# Altium schematic sheet 10-USB-Prog.SchDoc
size B; SheetNumber: 10; SheetTotal: 16
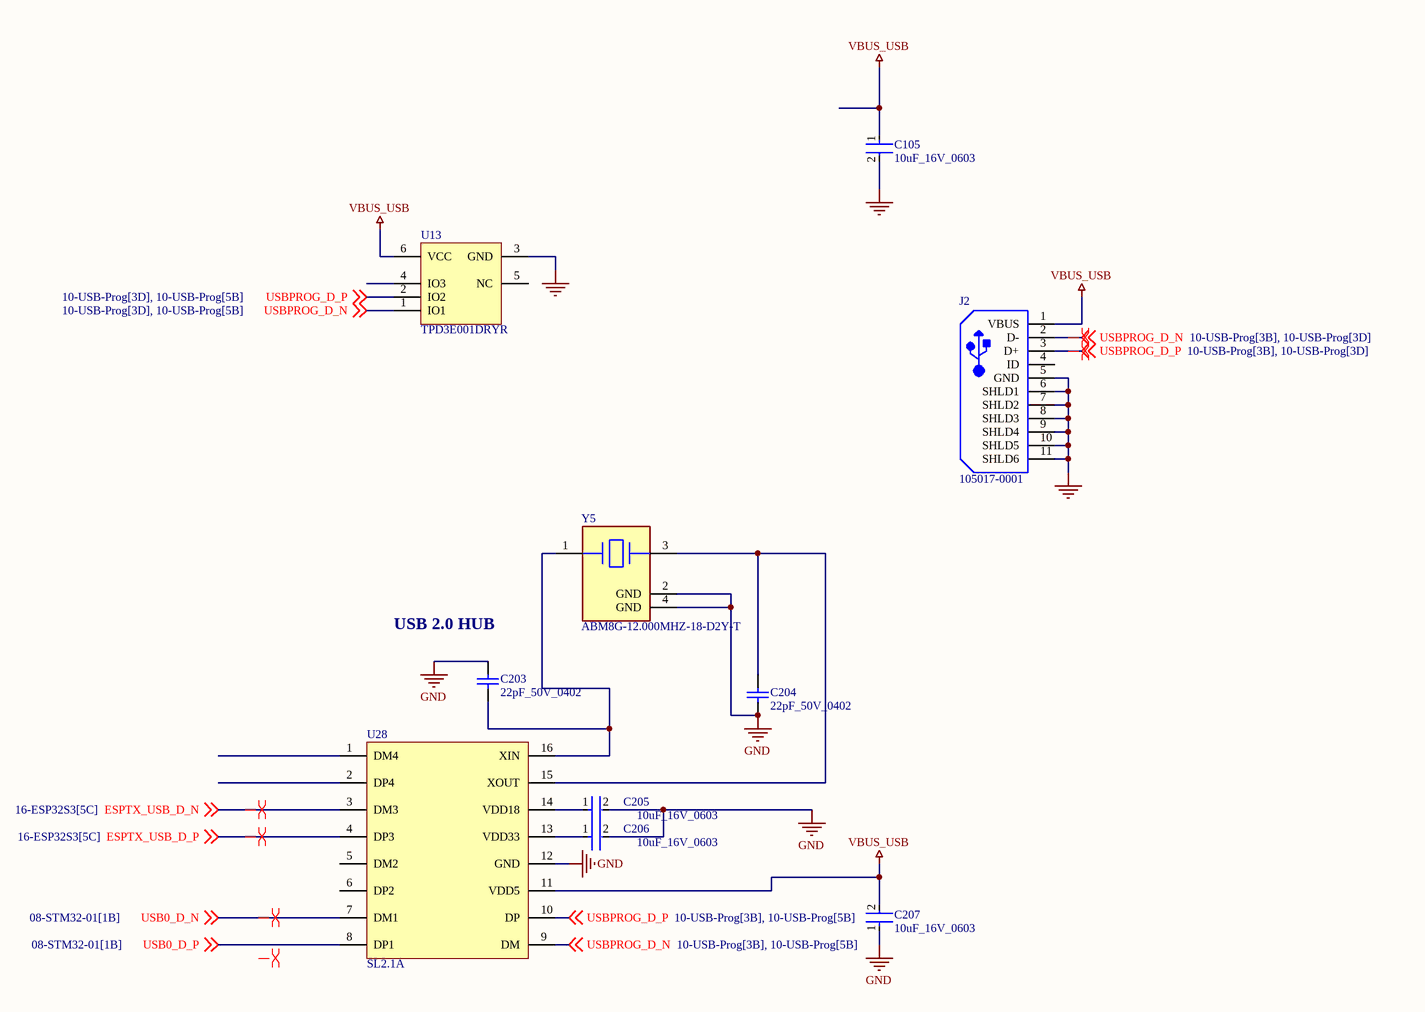
[diagram p0: 10-USB-Prog.SchDoc]

## Parts
C105  10uF_16V_0603  [FP-0603-L_1_6_0_2-W_0_8_0-MFG]
C203  22pF_50V_0402  [CAPC1005X55X25ML05T05]
C204  22pF_50V_0402  [CAPC1005X55X25ML05T05]
C205  10uF_16V_0603  [FP-0603-L_1_6_0_2-W_0_8_0-MFG]
C206  10uF_16V_0603  [FP-0603-L_1_6_0_2-W_0_8_0-MFG]
C207  10uF_16V_0603  [FP-0603-L_1_6_0_2-W_0_8_0-MFG]
J2  105017-0001  [USB-MICRO-B_V]
U13  TPD3E001DRYR  [DRY0006A]
U28  SL2.1A  [IC_SL2.1A]
Y5  ABM8G-12.000MHZ-18-D2Y-T  [FP-ABM8G-MFG]

## Nets
GND: C105.2 C203.2 C204.1 C205.2 C206.2 C207.1 J2.5(GND) J2.6(SHLD1) J2.7(SHLD2) J2.8(SHLD3) J2.9(SHLD4) J2.10(SHLD5) J2.11(SHLD6) U13.3(GND) U28.12(GND) Y5.2(GND) Y5.4(GND)
VBUS_USB: C105.1 C207.2 J2.1(VBUS) U13.6(VCC) U28.11(VDD5)
ESPTX_USB_D_N: U28.3(DM3) ; off-sheet ESPTX_USB_D_N
ESPTX_USB_D_P: U28.4(DP3) ; off-sheet ESPTX_USB_D_P
USB0_D_N: U28.7(DM1) ; off-sheet USB0_D_N
USB0_D_P: U28.8(DP1) ; off-sheet USB0_D_P
USBPROG_D_N: J2.2(D-) U13.1(IO1) U28.9(DM) ; off-sheet USBPROG_D_N
USBPROG_D_P: J2.3(D+) U13.2(IO2) U28.10(DP) ; off-sheet USBPROG_D_P
NetC203_1: C203.1 U28.16(XIN) Y5.1
NetC204_2: C204.2 U28.15(XOUT) Y5.3
NetC205_1: C205.1 U28.14(VDD18)
NetC206_1: C206.1 U28.13(VDD33)

Not connected (* = marked no-connect by the designer): J2 4(ID); U13 4(IO3) 5(NC); U28 1(DM4) 2(DP4) 5(DM2) 6(DP2)

## Layout directives
differential pair: (no net found under the mark), ESPTX_USB_D_N, ESPTX_USB_D_P, USB0_D_N, USBPROG_D_N, USBPROG_D_P

## Notes on the sheet
- (near C203) USB 2.0 HUB

## Library data of the parts
C105 C205-C207 = CMP-2000-06226-4: Multilayer Ceramic Capacitor 10uF 16V X5R 20% SMD 0603 T/R; Packaging: Tape and Reel; Construction: Flat; Height: 0.8mm; Max Operating Temperature: 85°C; Dielectric: X5R; Case Code (Metric): 1608; Voltage Rating (DC): 16V; Width: 0.031inch; Voltage Rating: 16V; Length: 0.063inch; RoHS Compliant: Yes; Halogen Free: Halogen Free; Case Code (Imperial): 0603; Capacitance: 10uF; Mount: Surface Mount; Thickness: 0.031inch; Tolerance: 20%; Min Operating Temperature: -55°C; Series: M; Termination: SMD/SMT; Case/Package: 0603; Package Quantity: 1
C203 C204 = CMP-2100-03590-1: Chip Capacitor, 22 pF, +/- 5%, 50 V, -55 to 125 degC, 0402 (1005 Metric), RoHS, Tape and Reel; Manufacturer: Yageo; Voltage Rating: 50V; Dielectric Material: Ceramic; Capacitance: 22pF; Temperature Coefficient: 30ppm/degC; Dielectric: C0G; Insulation Resistance: 100GR; Datasheet URL: http://www.yageo.com/NewPortal/yageodocoutput?fileName=/pdf/MLCC/UPY-GP_NP0_16V-to-50V_14.pdf; Depth: 0.5mm; Number of Pins: 2; Height: 0.5mm; Min Operating Temperature: -55degC; REACH SVHC: NoSVHC; Max Operating Temperature: 125degC; Voltage Rating (DC): 50V; Composition: Ceramic; Packaging: TapeandReel; Package Quantity: 1; Package Reference: 0402; Length: 1mm; Radiation Hardening: No; Package Description: 2-Pin Surface Mount Device, Body 1 x 0.5 mm; RoHSCompliant: True; Thickness: 0.022inch; Manufacturer URL: http://www.yageo.com/; Mount: SurfaceMount; Case Code (Metric): 1005; Case/Package: 0402; Tolerance: 5%; Termination: SMD/SMT; Width: 0.02inch; Datasheet Version: Rev. 14, 07/2016; Lead Free: LeadFree; Case Code (Imperial): 0402
J2 = CMP-2000-05827-1: Micro-USB B Receptacle, Right Angle, Bottom Mount, Surface Mount, with Solder Tabs, -30 to 85 degC, 5-Pin USB, RoHS, Tape and Reel; Manufacturer: Molex; Featured Product: Micro-USBConnectorsUSBConnectors; Other Names: WM1399DKR; Package Version: Rev. F, 12/2012; Number of Contacts: 5; Connector Type: USB-microB; Catalog Drawings: 1050170001; 3D Model: 105017-0001.stp; Mating Products: WM17145-ND-CABLEMICROUSBBTOSTDA1.0MWM17147-ND-CABLEMICROUSBBTOSTDA2.0MWM17146-ND-CABLEMICROUSBBTOSTDA1.5M; PCN Assembly/Origin: ResinSupplier21/Oct/2015; Voltage - Max: 30V; Online Catalog: Molex-MicroUSB; Manufacturer URL: http://www.molex.com/; Package Description: 5-Leads USB, Micro B, Body 7.5 x 5 mm, Pitch 0.65 mm; Datasheet URL: http://www.molex.com/elqNow/elqRedir.htm?ref=http://www.molex.com/webdocs/datasheets/pdf/en-us/1050170001_IO_CONNECTORS.pdf; Ingress Protection: -; Datasheet Version: 03/2016; Mounting Type: BoardCutout,SurfaceMount,RightAngle; Circuits: 5; Standard Package: 1; Package Reference: MICRO-B; Package URL: http://www.molex.com/pdm_docs/sd/1050170001_sd.pdf; Category: Connectors,Interconnects; Series: -; RoHS Information: 1050170001CertofCompliance; Features: Shielded,SolderRetention; Family: USB,DVI,HDMIConnectors; Specifications: -; Gender: Receptacle; Packaging: Digi-Reel®; Mounting Technology: SurfaceMount
U13 = CMP-0326-00032-3: Low-Capacitance + / - 15 kV ESD-Protection Array for High-Speed Data Interfaces, 3 Channels, -40 to +85 degC, 6-pin SON (DRY), Green (RoHS & no Sb/Br); Manufacturer: Texas Instruments; USB High Speed: TRUE; SubFamily: ESD Solution; IO Capacitance(Typ)(pF): 1.5; IEC 61000-4-2 Contact(+/- kV): 8; IO Leakage Current(nA): Jan-00; Breakdown Voltage(Min)(V): 11; IEC 61000-4-2 Air-Gap(+/- kV): 15; DatasheetVersion: SLLS683D; Mounting Technology: Surface Mount; ComponentLink1URL: http://www.ti.com/; PackageReference: DRY0006A; ComponentLink2URL: http://www.ti.com/general/docs/lit/getliterature.tsp?genericPartNumber=TPD3E001&fileType=pdf; ComponentLink2Description: Datasheet; ComponentLink3Description: URL Link1; PackageDescription: 6-Pin Plastic Small Outline No-Lead, 1 x 1.45 x 0.6 mm Body, 0.5 mm Pitch; ComponentLink1Description: Manufacturer URL; PackageVersion: revF, Dec-2011; PartNumber: TPD3E001DRYR; Eco-Plan: Green (RoHS & no Sb/Br); ComponentLink3URL: SamplesURL:http://www.ti.com/product/tpd3e001#samples
U28 = IC_SL2.1A: USB 2.0 HIGH SPEED 4-PORT HUB CONTROLLER; MF: CoreChips ShenZhen CO.,Ltd; Check_prices: https://www.snapeda.com/parts/SL2.1A/CoreChips%20ShenZhen%20CO.,Ltd/view-part/4219225/?ref=eda; Price: None; Availability: No availability data; Value: *; SnapEDA_Link: https://www.snapeda.com/parts/SL2.1A/CoreChips%20ShenZhen%20CO.,Ltd/view-part/4219225/?ref=snap; MP: SL2.1A; Package: Package; Supplier 1: LCSC; Supplier Part Number 1: C192893
Y5 = CMP-2000-05039-3: Crystal 12MHz ±20ppm (Tol) ±30ppm (Stability) 18pF FUND 120Ω 4-Pin SMD T/R; Series Resistance: 120R; Max Operating Temperature: 85°C; Mount: Surface Mount; Width: 2.5mm; Series: ABM8G; Termination: SMD/SMT; Frequency Tolerance: 20ppm; Tolerance: 20ppm; Min Operating Temperature: -40°C; Operating Frequency: 12 MHz; Depth: 2.5mm; Load Capacitance: 18pF; Number of Pins: 4; Length: 3.2mm; Radiation Hardening: No; Frequency Stability: 30ppm; Height: 1mm; Packaging: Tape and Reel; Package Quantity: 1000; ESR (Equivalent Series Resistance): 120R; Lead Free: Lead Free; Frequency: 12MHz; Case/Package: CSMD